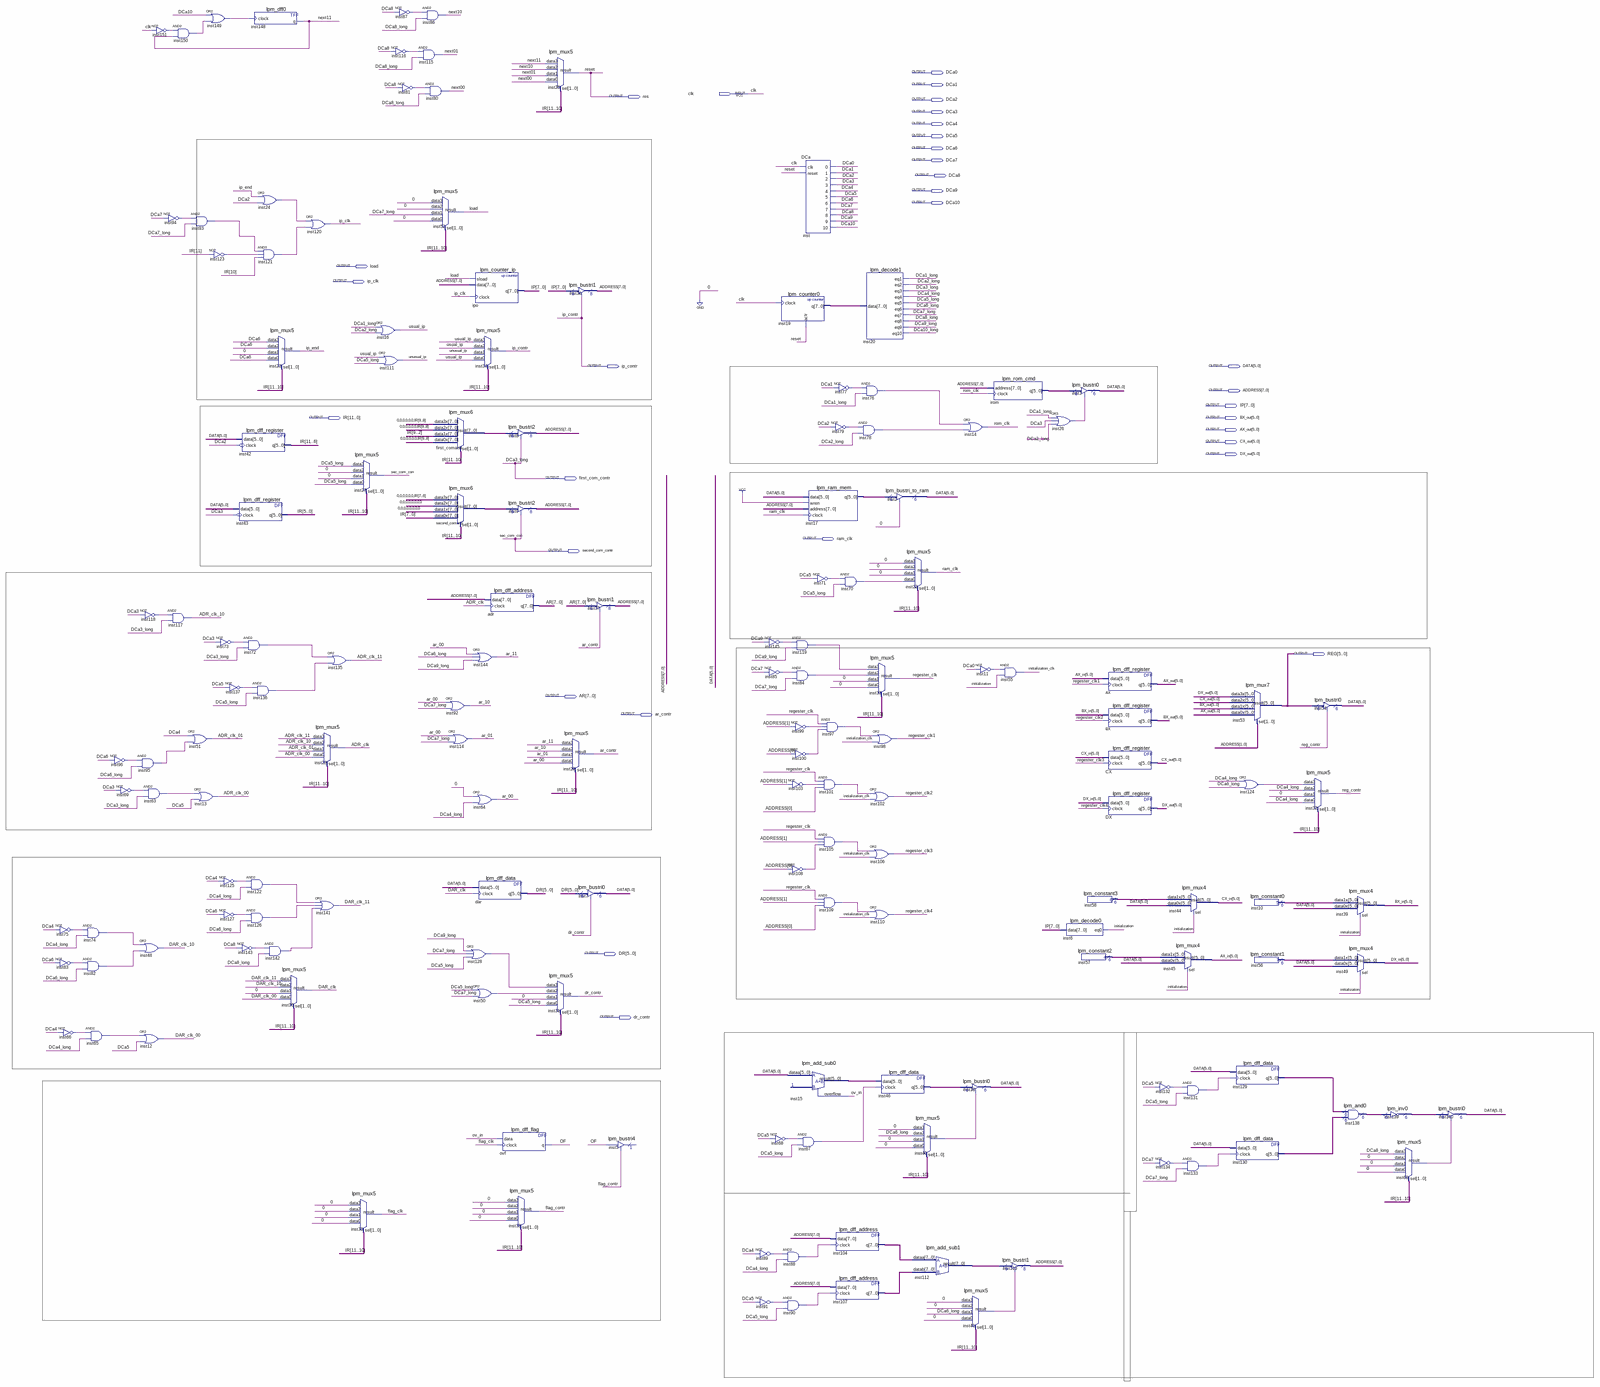
[diagram p0: schematic sheet, whole]
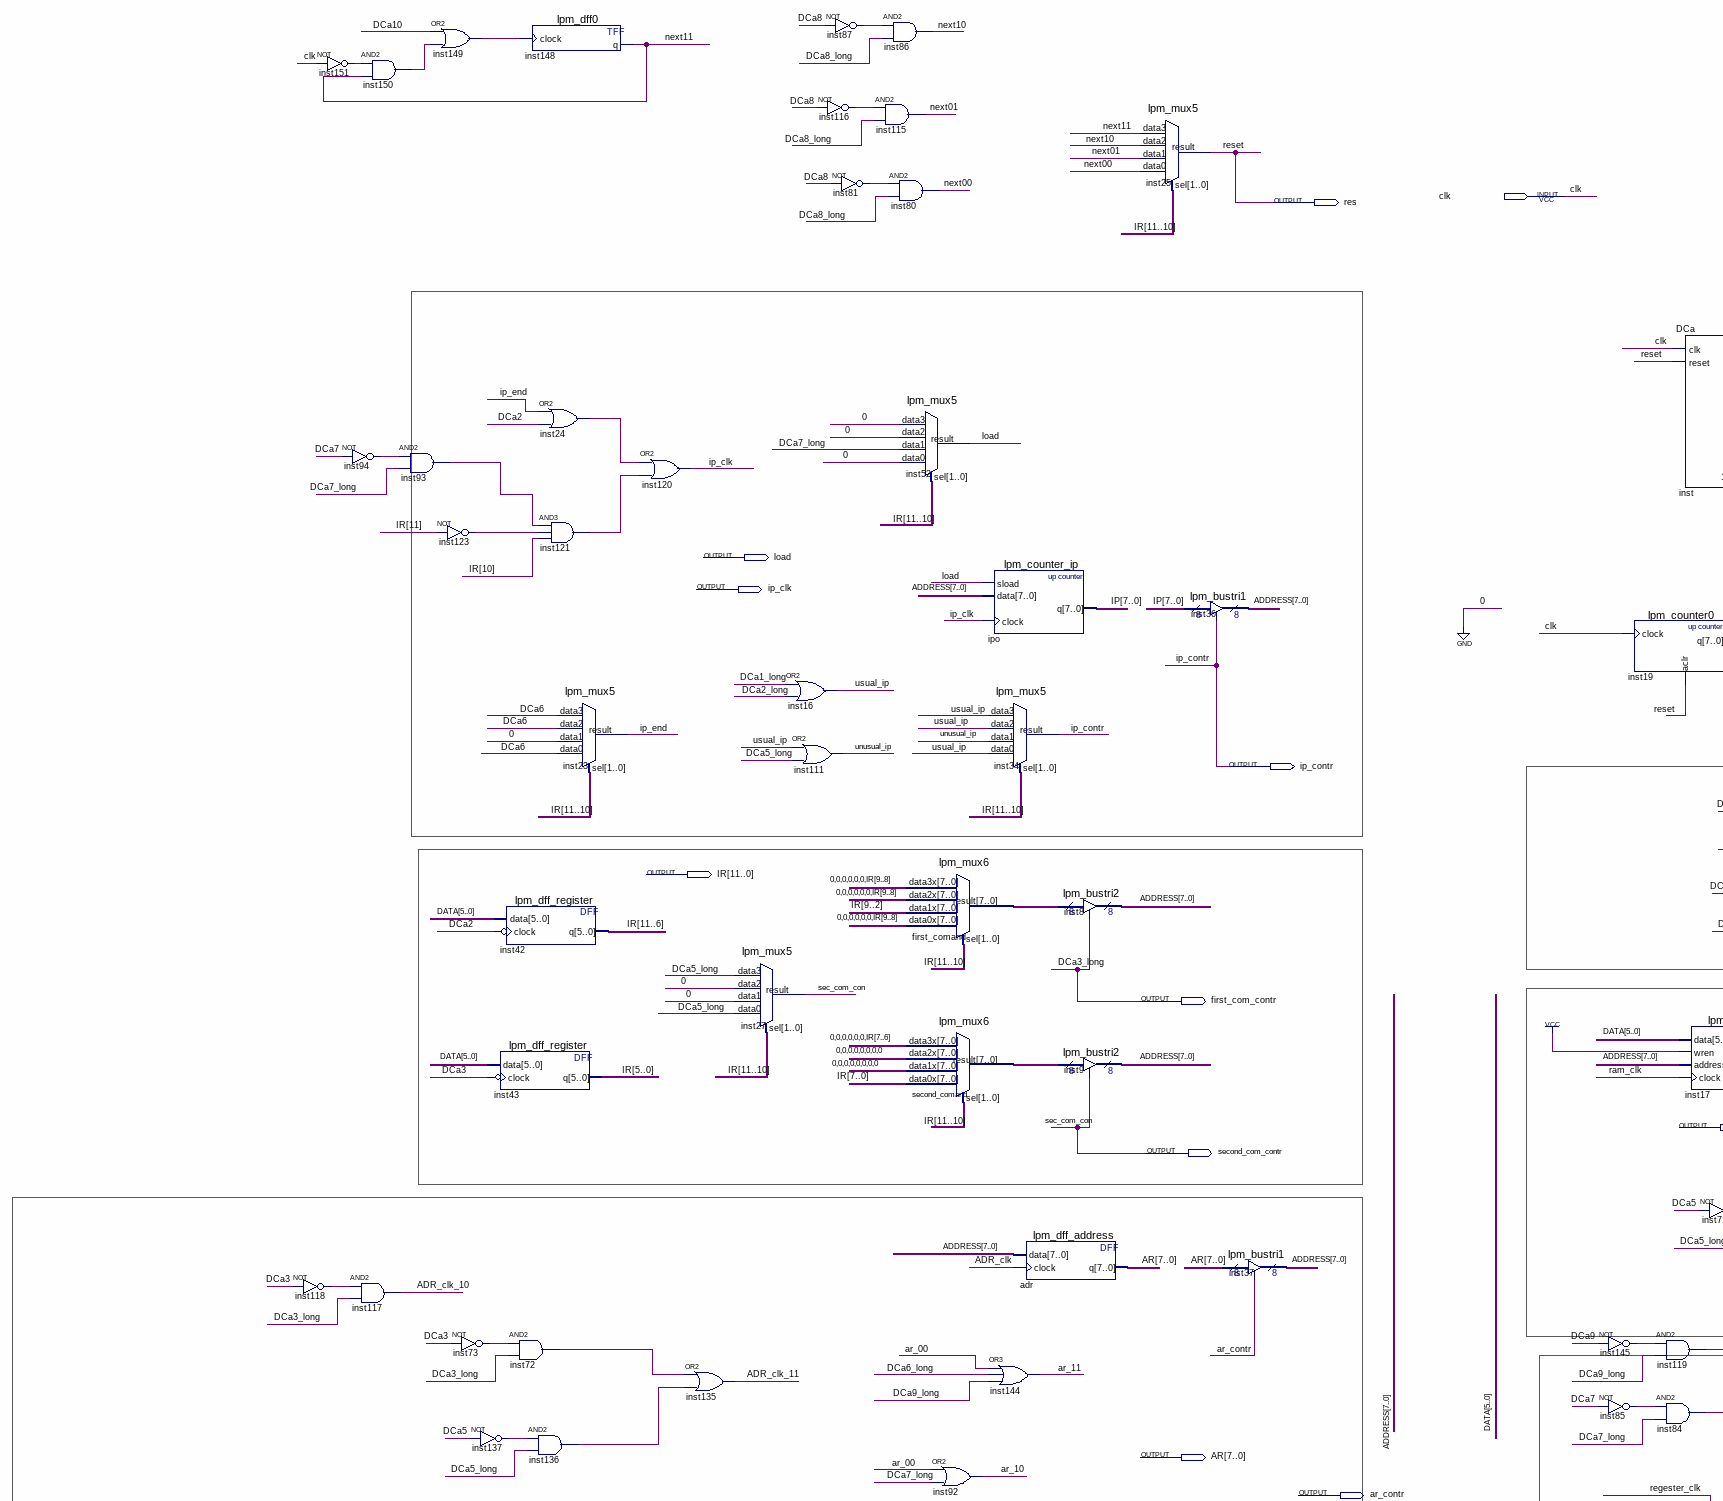
[diagram p1: schematic sheet, upper left part]
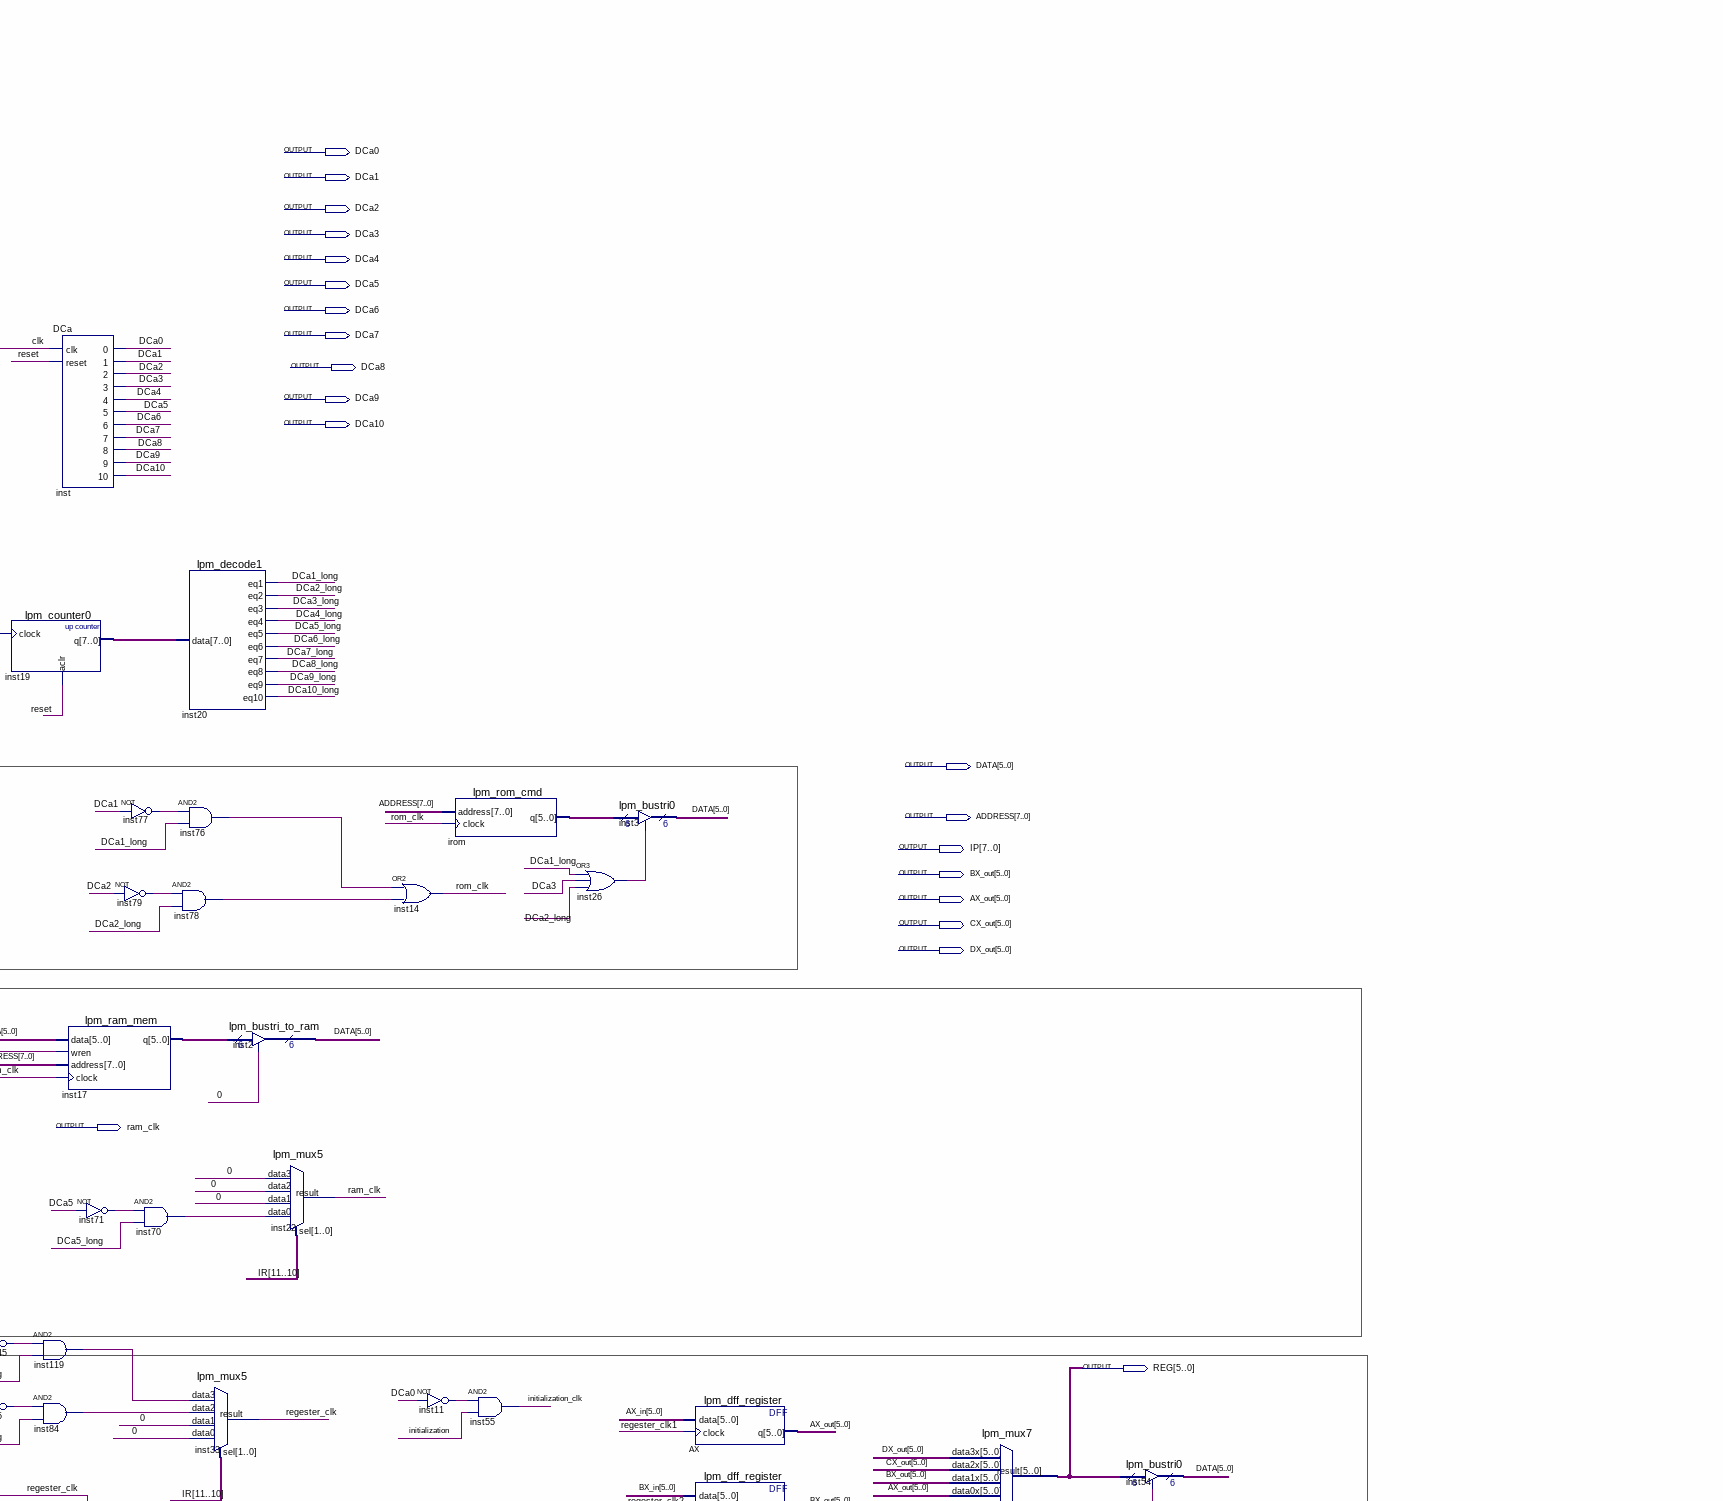
[diagram p2: schematic sheet, upper right part]
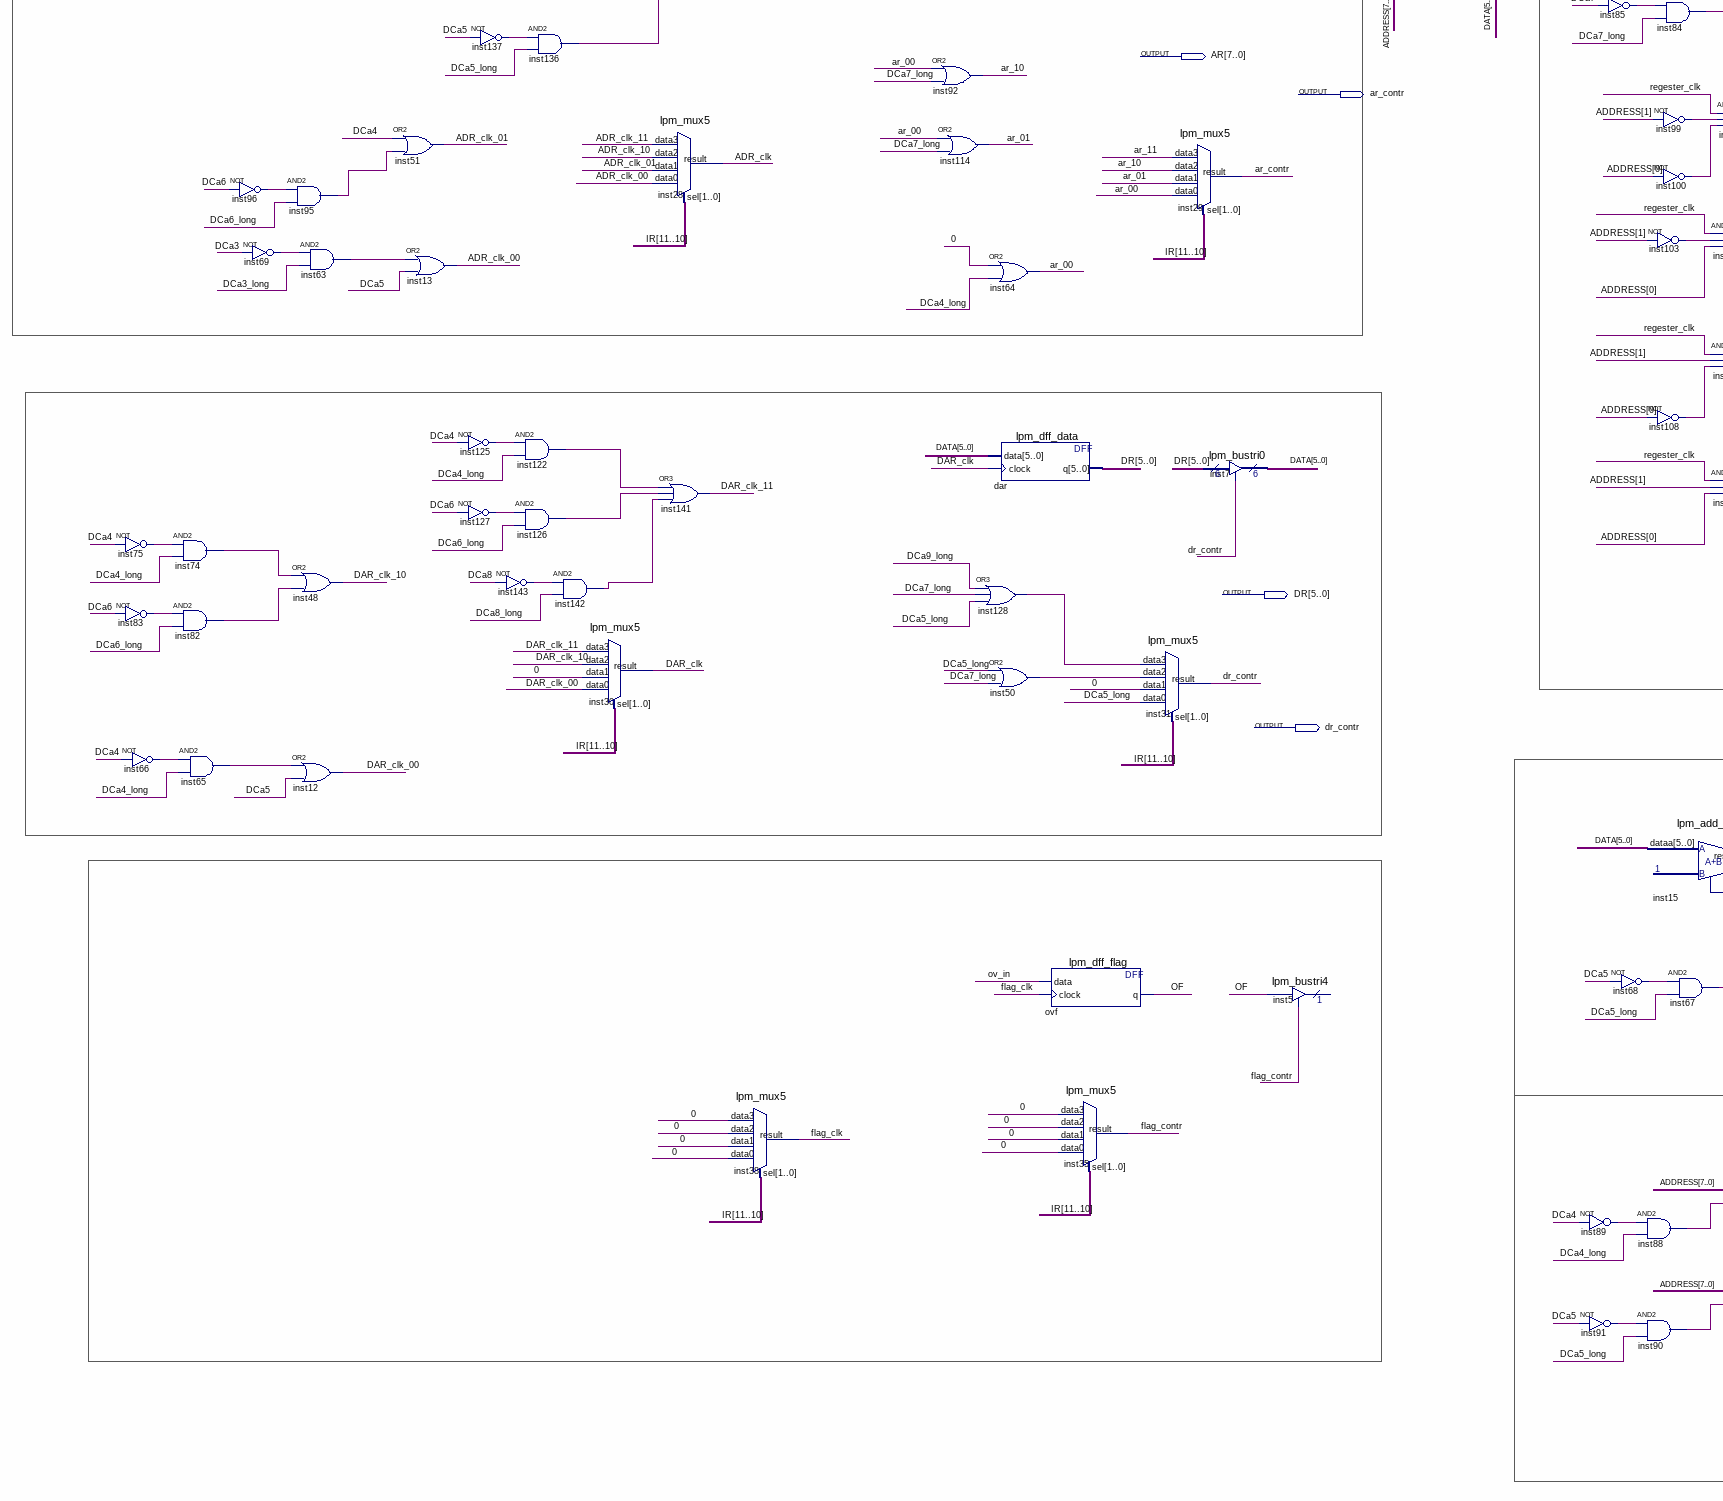
[diagram p3: schematic sheet, lower left part]
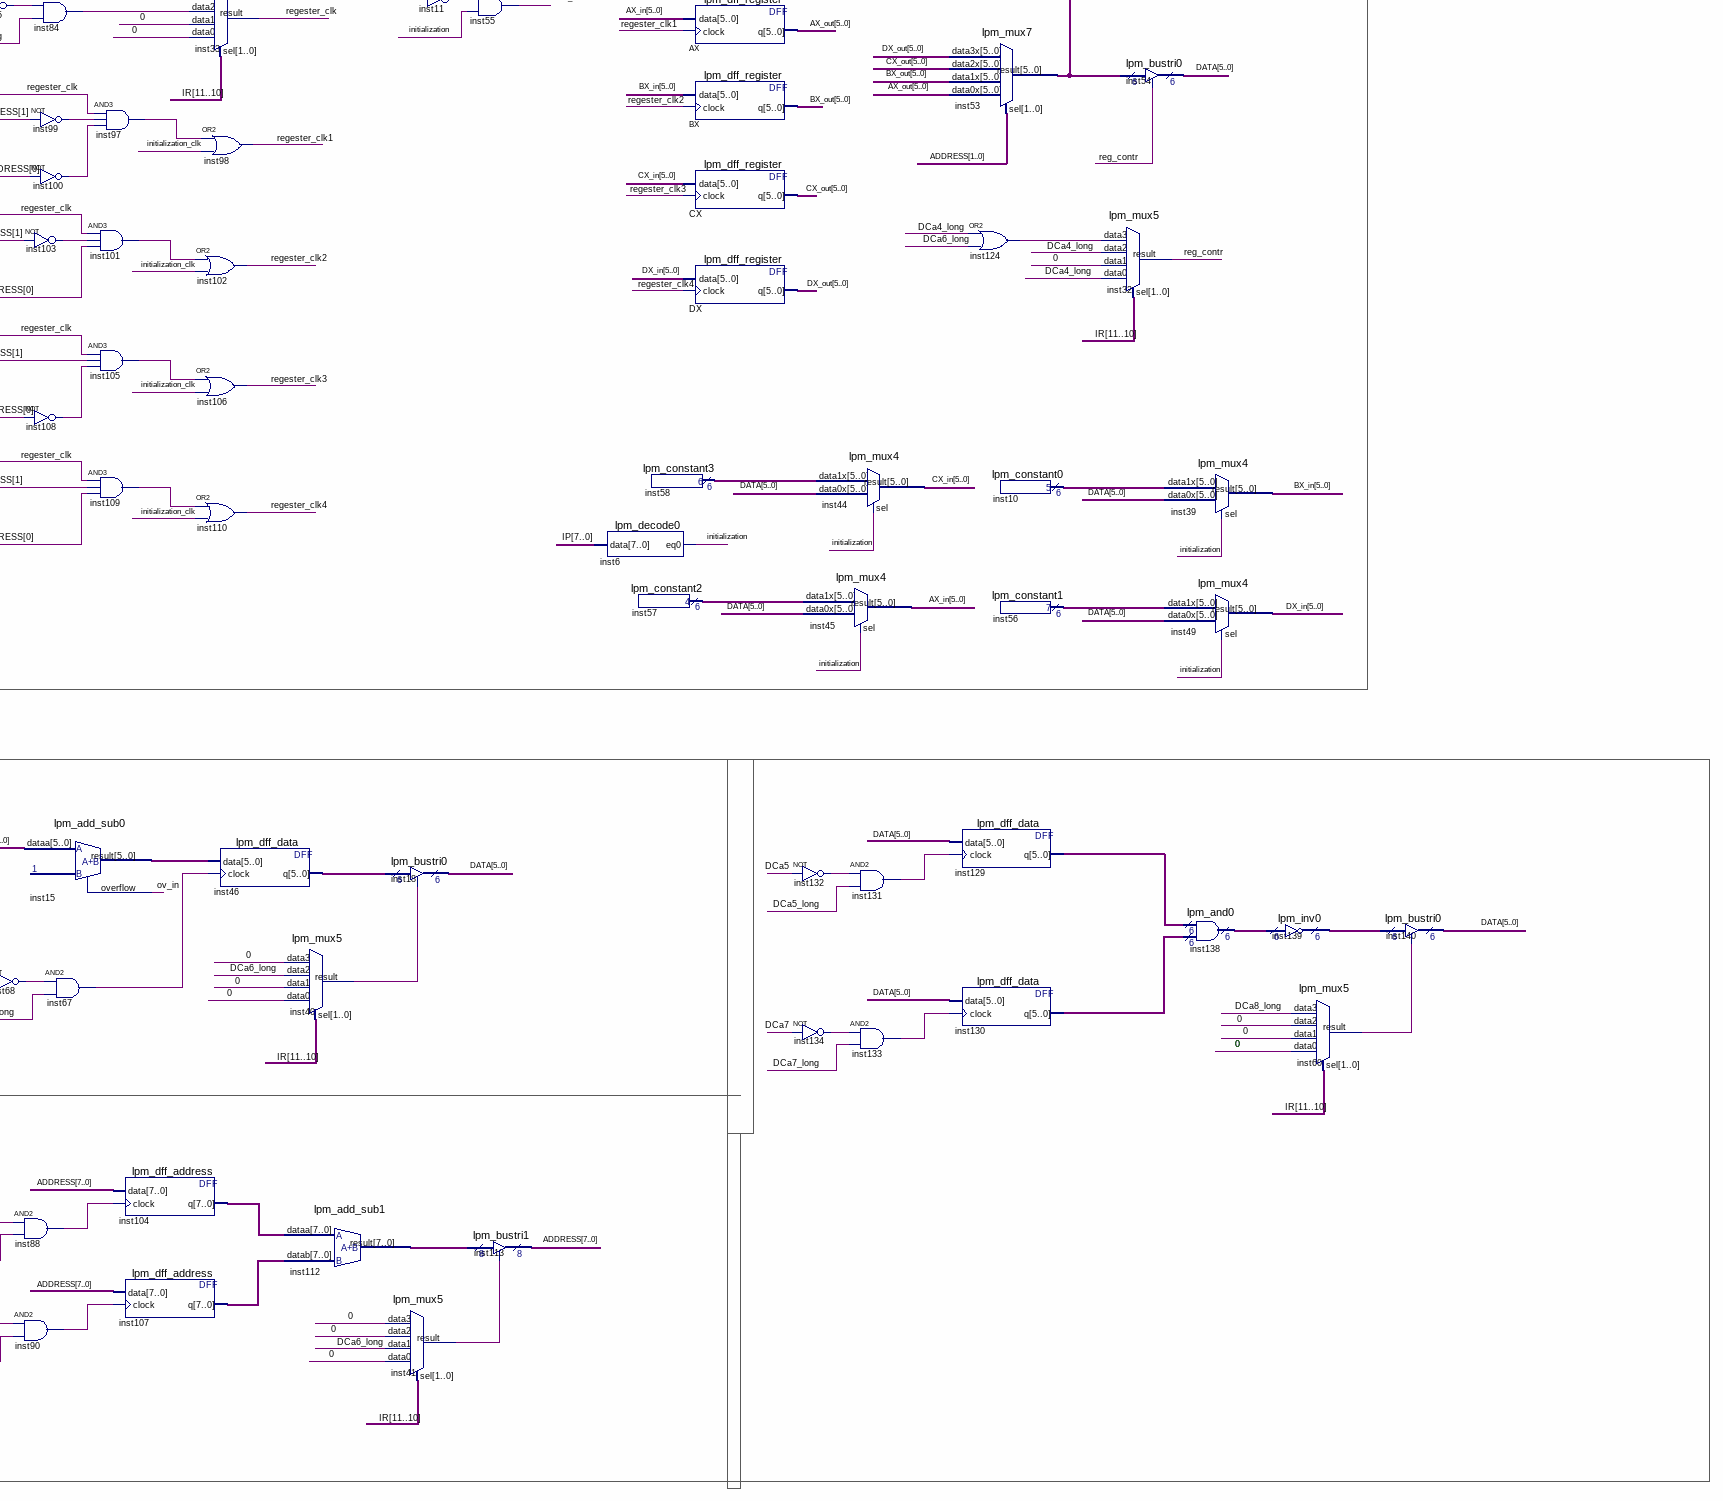
[diagram p4: schematic sheet, lower right part]
// Quartus schematic result.bdf as structural Verilog: 154 symbols, 32 pins
module result (
  input  clk,
  output DCa0,
  output DCa1,
  output res,
  output DCa2,
  output DCa3,
  output DCa4,
  output DCa5,
  output DCa6,
  output DCa7,
  output DCa8,
  output DCa9,
  output DCa10,
  output load,
  output ip_clk,
  output ip_contr,
  output [5:0] DATA,
  output [7:0] ADDRESS,
  output [7:0] IP,
  output [11:0] IR,
  output [5:0] BX_out,
  output [5:0] AX_out,
  output [5:0] CX_out,
  output [5:0] DX_out,
  output first_com_contr,
  output ram_clk,
  output second_com_contr,
  output [5:0] REG,
  output [7:0] AR,
  output ar_contr,
  output [5:0] DR,
  output dr_contr
);

  wire ADR_clk, ADR_clk_00, ADR_clk_01, ADR_clk_10, ADR_clk_11, ar_00, ar_01, ar_10, ar_11, DAR_clk,
       DAR_clk_00, DAR_clk_10, DAR_clk_11, DCa1_long, DCa2_long, DCa4_long, DCa5_long, DCa6_long, DCa7_long,
       DCa8_long, DCa9_long, DCa10_long, flag_clk, flag_contr, initialization, initialization_clk,
       inst11_out, inst24_out, inst26_out, inst40_result, inst41_result, inst50_out, inst60_result,
       inst63_out, inst65_out, inst66_out, inst67_out, inst68_out, inst69_out, inst70_out, inst71_out,
       inst72_out, inst73_out, inst74_out, inst75_out, inst76_out, inst77_out, inst78_out, inst79_out,
       inst81_out, inst82_out, inst83_out, inst84_out, inst85_out, inst87_out, inst88_out, inst89_out,
       inst90_out, inst91_out, inst93_out, inst94_out, inst95_out, inst96_out, inst97_out, inst99_out,
       inst100_out, inst101_out, inst103_out, inst105_out, inst108_out, inst109_out, inst116_out,
       inst118_out, inst119_out, inst121_out, inst122_out, inst123_out, inst124_out, inst125_out,
       inst126_out, inst127_out, inst128_out, inst131_out, inst132_out, inst133_out, inst134_out,
       inst136_out, inst137_out, inst142_out, inst143_out, inst145_out, inst149_out, inst150_out,
       inst151_out, ip_end, next00, next01, next10, next11, OF, ov_in, reg_contr, regester_clk,
       regester_clk1, regester_clk2, regester_clk3, regester_clk4, rom_clk, unusual_ip, usual_ip;
  wire [5:0] AX_in, BX_in, CX_in, DX_in, inst10_result, inst15_result, inst17_q, inst46_q, inst56_result,
       inst57_result, inst58_result, inst129_q, inst130_q, inst138_result, inst139_result, irom_q;
  wire [7:0] first_comand_result, inst19_q, inst104_q, inst107_q, inst112_result, second_comand_result;

  not inst75 (inst75_out, DCa4);
  not inst83 (inst83_out, DCa6);
  not inst66 (inst66_out, DCa4);
  and inst74 (inst74_out, inst75_out, DCa4_long);
  and inst82 (inst82_out, inst83_out, DCa6_long);
  and inst65 (inst65_out, inst66_out, DCa4_long);
  not inst96 (inst96_out, DCa6);
  not inst69 (inst69_out, DCa3);
  not inst151 (inst151_out, clk);
  not inst118 (inst118_out, DCa3);
  and inst95 (inst95_out, inst96_out, DCa6_long);
  and inst63 (inst63_out, inst69_out, first_com_contr);
  or inst48 (DAR_clk_10, inst74_out, inst82_out);
  or inst12 (DAR_clk_00, inst65_out, DCa5);
  and inst150 (inst150_out, inst151_out, next11);
  not inst94 (inst94_out, DCa7);
  and inst117 (ADR_clk_10, inst118_out, first_com_contr);
  and inst93 (inst93_out, inst94_out, DCa7_long);
  or inst51 (ADR_clk_01, DCa4, inst95_out);
  or inst13 (ADR_clk_00, inst63_out, DCa5);
  or inst149 (inst149_out, DCa10, inst150_out);
  not inst123 (inst123_out, IR[11]);
  not inst73 (inst73_out, DCa3);
  not inst137 (inst137_out, DCa5);
  not inst125 (inst125_out, DCa4);
  not inst127 (inst127_out, DCa6);
  lpm_dff0 inst148 (.clock(inst149_out), .q(next11));
  lpm_dff_register inst42 (.data(DATA), .clock(~DCa2), .q(IR[11:6]));
  lpm_dff_register inst43 (.data(DATA), .clock(~DCa3), .q(IR[5:0]));
  and inst72 (inst72_out, inst73_out, first_com_contr);
  and inst122 (inst122_out, inst125_out, DCa4_long);
  and inst126 (inst126_out, inst127_out, DCa6_long);
  not inst143 (inst143_out, DCa8);
  or inst24 (inst24_out, ip_end, DCa2);
  and inst121 (inst121_out, inst93_out, inst123_out, IR[10]);
  lpm_mux5 inst23 (.data3(DCa6), .data2(DCa6), .data1(1'b0), .data0(DCa6), .sel(IR[11:10]), .result(ip_end));
  and inst136 (inst136_out, inst137_out, DCa5_long);
  and inst142 (inst142_out, inst143_out, DCa8_long);
  lpm_mux5 inst30 (
    .data3(DAR_clk_11), .data2(DAR_clk_10), .data1(1'b0), .data0(DAR_clk_00), .sel(IR[11:10]),
    .result(DAR_clk));
  or inst120 (ip_clk, inst24_out, inst121_out);
  lpm_mux5 inst28 (
    .data3(ADR_clk_11), .data2(ADR_clk_10), .data1(ADR_clk_01), .data0(ADR_clk_00), .sel(IR[11:10]),
    .result(ADR_clk));
  or inst141 (DAR_clk_11, inst122_out, inst126_out, inst142_out);
  or inst135 (ADR_clk_11, inst72_out, inst136_out);
  lpm_mux5 inst27 (
    .data3(DCa5_long), .data2(1'b0), .data1(1'b0), .data0(DCa5_long), .sel(IR[11:10]),
    .result(second_com_contr));
  lpm_mux5 inst38 (.data3(1'b0), .data2(1'b0), .data1(1'b0), .data0(1'b0), .sel(IR[11:10]), .result(flag_clk));
  not inst87 (inst87_out, DCa8);
  not inst116 (inst116_out, DCa8);
  or inst16 (usual_ip, DCa1_long, DCa2_long);
  or inst111 (unusual_ip, usual_ip, DCa5_long);
  and inst115 (next01, inst116_out, DCa8_long);
  not inst81 (inst81_out, DCa8);
  and inst86 (next10, inst87_out, DCa8_long);
  and inst80 (next00, inst81_out, DCa8_long);
  lpm_mux5 inst52 (.data3(1'b0), .data2(1'b0), .data1(DCa7_long), .data0(1'b0), .sel(IR[11:10]), .result(load));
  lpm_mux6 first_comand (
    .data3x({{6{1'b0}}, IR[9:8]}), .data2x({{6{1'b0}}, IR[9:8]}), .data1x(IR[9:2]),
    .data0x({{6{1'b0}}, IR[9:8]}), .sel(IR[11:10]), .result(first_comand_result));
  lpm_mux6 second_comand (
    .data3x({{6{1'b0}}, IR[7:6]}), .data2x({8{1'b0}}), .data1x({8{1'b0}}), .data0x(IR[7:0]), .sel(IR[11:10]),
    .result(second_comand_result));
  or inst92 (ar_10, ar_00, DCa7_long);
  or inst114 (ar_01, ar_00, DCa7_long);
  or inst128 (inst128_out, DCa9_long, DCa7_long, DCa5_long);
  lpm_counter_ip ipo (.sload(load), .data(ADDRESS), .clock(ip_clk), .q(IP));
  lpm_mux5 inst34 (
    .data3(usual_ip), .data2(usual_ip), .data1(unusual_ip), .data0(usual_ip), .sel(IR[11:10]),
    .result(ip_contr));
  lpm_dff_address adr (.data(ADDRESS), .clock(ADR_clk), .q(AR));
  or inst144 (ar_11, ar_00, DCa6_long, DCa9_long);
  or inst64 (ar_00, 1'b0, DCa4_long);
  lpm_dff_data dar (.data(DATA), .clock(DAR_clk), .q(DR));
  or inst50 (inst50_out, DCa5_long, DCa7_long);
  lpm_bustri2 inst8 (.enabledt(first_com_contr), .data(first_comand_result), .tridata(ADDRESS));
  lpm_bustri2 inst9 (.enabledt(second_com_contr), .data(second_comand_result), .tridata(ADDRESS));
  lpm_dff_flag ovf (.data(ov_in), .clock(flag_clk), .q(OF));
  lpm_mux5 inst35 (.data3(1'b0), .data2(1'b0), .data1(1'b0), .data0(1'b0), .sel(IR[11:10]), .result(flag_contr));
  lpm_mux5 inst25 (.data3(next11), .data2(next10), .data1(next01), .data0(next00), .sel(IR[11:10]), .result(res));
  lpm_mux5 inst29 (.data3(ar_11), .data2(ar_10), .data1(ar_01), .data0(ar_00), .sel(IR[11:10]), .result(ar_contr));
  lpm_mux5 inst31 (
    .data3(inst128_out), .data2(inst50_out), .data1(1'b0), .data0(DCa5_long), .sel(IR[11:10]),
    .result(dr_contr));
  lpm_bustri1 inst36 (.enabledt(ip_contr), .data(IP), .tridata(ADDRESS));
  lpm_bustri1 inst37 (.enabledt(ar_contr), .data(AR), .tridata(ADDRESS));
  lpm_bustri0 inst7 (.enabledt(dr_contr), .data(DR), .tridata(DATA));
  lpm_bustri4 inst5 (.enabledt(flag_contr), .data(OF));  // open: tridata
  not inst89 (inst89_out, DCa4);
  not inst91 (inst91_out, DCa5);
  lpm_counter0 inst19 (.clock(clk), .aclr(res), .q(inst19_q));
  not inst145 (inst145_out, DCa9);
  not inst85 (inst85_out, DCa7);
  not inst68 (inst68_out, DCa5);
  and inst88 (inst88_out, inst89_out, DCa4_long);
  and inst90 (inst90_out, inst91_out, DCa5_long);
  DCa inst (
    .clk(clk), .reset(res), .\0 (DCa0), .\1 (DCa1), .\2 (DCa2), .\3 (DCa3), .\4 (DCa4), .\5 (DCa5),
    .\6 (DCa6), .\7 (DCa7), .\8 (DCa8), .\9 (DCa9), .\10 (DCa10));
  lpm_ram_mem inst17 (.data(DATA), .wren(1'b1), .address(ADDRESS), .clock(ram_clk), .q(inst17_q));
  and inst119 (inst119_out, inst145_out, DCa9_long);
  and inst84 (inst84_out, inst85_out, DCa7_long);
  not inst99 (inst99_out, ADDRESS[1]);
  not inst100 (inst100_out, ADDRESS[0]);
  not inst103 (inst103_out, ADDRESS[1]);
  not inst108 (inst108_out, ADDRESS[0]);
  lpm_add_sub0 inst15 (.dataa(DATA), .result(inst15_result), .overflow(ov_in));
  and inst67 (inst67_out, inst68_out, DCa5_long);
  not inst79 (inst79_out, DCa2);
  not inst71 (inst71_out, DCa5);
  and inst97 (inst97_out, regester_clk, inst99_out, inst100_out);
  and inst101 (inst101_out, regester_clk, inst103_out, ADDRESS[0]);
  and inst105 (inst105_out, regester_clk, ADDRESS[1], inst108_out);
  and inst109 (inst109_out, regester_clk, ADDRESS[1], ADDRESS[0]);
  lpm_dff_address inst104 (.data(ADDRESS), .clock(inst88_out), .q(inst104_q));
  lpm_dff_address inst107 (.data(ADDRESS), .clock(inst90_out), .q(inst107_q));
  not inst77 (inst77_out, DCa1);
  and inst70 (inst70_out, inst71_out, DCa5_long);
  lpm_decode1 inst20 (
    .data(inst19_q), .eq1(DCa1_long), .eq2(DCa2_long), .eq3(first_com_contr), .eq4(DCa4_long),
    .eq5(DCa5_long), .eq6(DCa6_long), .eq7(DCa7_long), .eq8(DCa8_long), .eq9(DCa9_long), .eq10(DCa10_long));
  and inst76 (inst76_out, inst77_out, DCa1_long);
  and inst78 (inst78_out, inst79_out, DCa2_long);
  lpm_mux5 inst33 (
    .data3(inst119_out), .data2(inst84_out), .data1(1'b0), .data0(1'b0), .sel(IR[11:10]),
    .result(regester_clk));
  or inst98 (regester_clk1, inst97_out, initialization_clk);
  or inst102 (regester_clk2, inst101_out, initialization_clk);
  or inst106 (regester_clk3, inst105_out, initialization_clk);
  or inst110 (regester_clk4, inst109_out, initialization_clk);
  lpm_dff_data inst46 (.data(inst15_result), .clock(inst67_out), .q(inst46_q));
  lpm_bustri_to_ram inst2 (.enabledt(1'b0), .data(inst17_q), .tridata(DATA));
  lpm_mux5 inst22 (.data3(1'b0), .data2(1'b0), .data1(1'b0), .data0(inst70_out), .sel(IR[11:10]), .result(ram_clk));
  lpm_mux5 inst40 (
    .data3(1'b0), .data2(DCa6_long), .data1(1'b0), .data0(1'b0), .sel(IR[11:10]), .result(inst40_result));
  lpm_add_sub1 inst112 (.dataa(inst104_q), .datab(inst107_q), .result(inst112_result));
  or inst14 (rom_clk, inst76_out, inst78_out);
  not inst11 (inst11_out, DCa0);
  lpm_bustri0 inst18 (.enabledt(inst40_result), .data(inst46_q), .tridata(DATA));
  lpm_mux5 inst41 (
    .data3(1'b0), .data2(1'b0), .data1(DCa6_long), .data0(1'b0), .sel(IR[11:10]), .result(inst41_result));
  lpm_rom_cmd irom (.address(ADDRESS), .clock(rom_clk), .q(irom_q));
  and inst55 (initialization_clk, inst11_out, initialization);
  lpm_bustri1 inst113 (.enabledt(inst41_result), .data(inst112_result), .tridata(ADDRESS));
  lpm_bustri0 inst3 (.enabledt(inst26_out), .data(irom_q), .tridata(DATA));
  or inst26 (inst26_out, DCa1_long, DCa3, DCa2_long);
  lpm_decode0 inst6 (.data(IP), .eq0(initialization));
  lpm_constant3 inst58 (.result(inst58_result));
  lpm_constant2 inst57 (.result(inst57_result));
  lpm_dff_register AX (.data(AX_in), .clock(regester_clk1), .q(AX_out));
  lpm_dff_register BX (.data(BX_in), .clock(regester_clk2), .q(BX_out));
  lpm_dff_register CX (.data(CX_in), .clock(regester_clk3), .q(CX_out));
  lpm_dff_register DX (.data(DX_in), .clock(regester_clk4), .q(DX_out));
  lpm_mux4 inst44 (.data1x(inst58_result), .data0x(DATA), .sel(initialization), .result(CX_in));
  lpm_mux4 inst45 (.data1x(inst57_result), .data0x(DATA), .sel(initialization), .result(AX_in));
  not inst132 (inst132_out, DCa5);
  not inst134 (inst134_out, DCa7);
  and inst131 (inst131_out, inst132_out, DCa5_long);
  and inst133 (inst133_out, inst134_out, DCa7_long);
  lpm_mux7 inst53 (
    .data3x(DX_out), .data2x(CX_out), .data1x(BX_out), .data0x(AX_out), .sel(ADDRESS[1:0]), .result(REG));
  or inst124 (inst124_out, DCa4_long, DCa6_long);
  lpm_dff_data inst129 (.data(DATA), .clock(inst131_out), .q(inst129_q));
  lpm_dff_data inst130 (.data(DATA), .clock(inst133_out), .q(inst130_q));
  lpm_constant0 inst10 (.result(inst10_result));
  lpm_constant1 inst56 (.result(inst56_result));
  lpm_bustri0 inst54 (.enabledt(reg_contr), .data(REG), .tridata(DATA));
  lpm_mux5 inst32 (
    .data3(inst124_out), .data2(DCa4_long), .data1(1'b0), .data0(DCa4_long), .sel(IR[11:10]),
    .result(reg_contr));
  lpm_mux4 inst39 (.data1x(inst10_result), .data0x(DATA), .sel(initialization), .result(BX_in));
  lpm_mux4 inst49 (.data1x(inst56_result), .data0x(DATA), .sel(initialization), .result(DX_in));
  lpm_and0 inst138 (.data0x(inst129_q), .data1x(inst130_q), .result(inst138_result));
  lpm_inv0 inst139 (.data(inst138_result), .result(inst139_result));
  lpm_mux5 inst60 (
    .data3(DCa8_long), .data2(1'b0), .data1(1'b0), .data0(1'b0), .sel(IR[11:10]), .result(inst60_result));
  lpm_bustri0 inst140 (.enabledt(inst60_result), .data(inst139_result), .tridata(DATA));

  // Other names for the same wires on the sheet: DCa3_long = first_com_contr; reset = res;
  //   sec_com_con = second_com_contr

  // Notes on the sheet:
  //   0
endmodule
